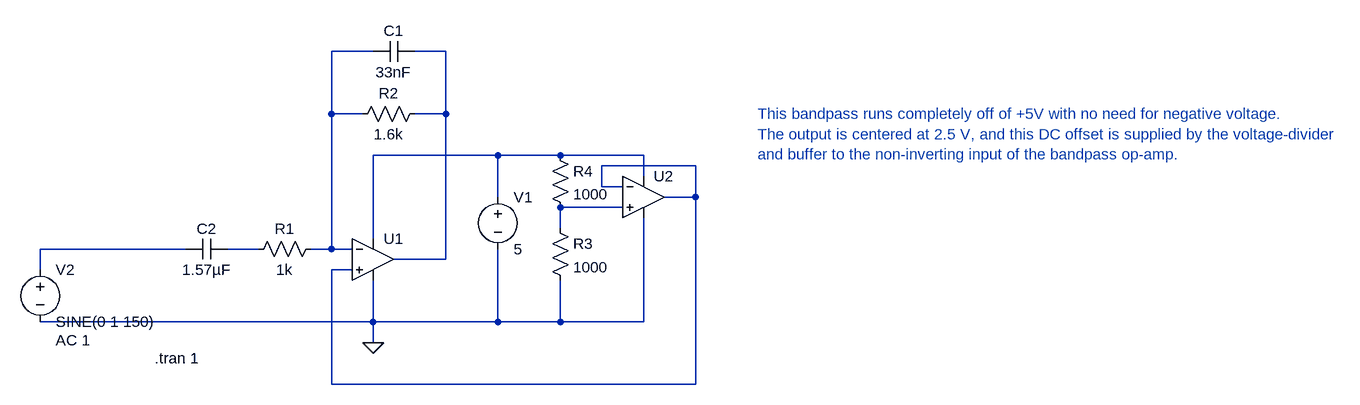
[diagram p0: schematic Bandpass_5Vsupply.asc]
Bandpass_5Vsupply.asc, the LTspice schematic file:
Version 4
SHEET 1 1728 680
WIRE 160 -160 96 -160
WIRE 272 -160 224 -160
WIRE 96 -64 96 -160
WIRE 144 -64 96 -64
WIRE 272 -64 272 -160
WIRE 272 -64 224 -64
WIRE 352 0 160 0
WIRE 448 0 352 0
WIRE 576 0 448 0
WIRE 656 16 512 16
WIRE 576 32 576 0
WIRE 512 48 512 16
WIRE 544 48 512 48
WIRE 352 64 352 0
WIRE 656 64 656 16
WIRE 656 64 608 64
WIRE 544 80 448 80
WIRE 448 112 448 80
WIRE 160 128 160 0
WIRE -128 144 -352 144
WIRE -16 144 -64 144
WIRE 96 144 96 -64
WIRE 96 144 64 144
WIRE 128 144 96 144
WIRE 272 160 272 -64
WIRE 272 160 192 160
WIRE -352 176 -352 144
WIRE 128 176 96 176
WIRE 160 256 160 192
WIRE 160 256 -352 256
WIRE 352 256 352 144
WIRE 352 256 160 256
WIRE 448 256 448 192
WIRE 448 256 352 256
WIRE 576 256 576 96
WIRE 576 256 448 256
WIRE 160 288 160 256
WIRE 96 352 96 176
WIRE 656 352 656 64
WIRE 656 352 96 352
FLAG 160 288 0
SYMBOL res 80 128 R90
WINDOW 0 0 56 VBottom 2
WINDOW 3 32 56 VTop 2
SYMATTR InstName R1
SYMATTR Value 1k
SYMBOL res 240 -80 R90
WINDOW 0 0 56 VBottom 2
WINDOW 3 32 56 VTop 2
SYMATTR InstName R2
SYMATTR Value 1.6k
SYMBOL OpAmps\\UniversalOpamp2 160 160 R0
SYMATTR InstName U1
SYMBOL voltage 352 48 R0
WINDOW 123 0 0 Left 0
WINDOW 39 0 0 Left 0
SYMATTR InstName V1
SYMATTR Value 5
SYMBOL voltage -352 160 R0
WINDOW 123 24 124 Left 2
WINDOW 39 0 0 Left 0
SYMATTR Value2 AC 1
SYMATTR InstName V2
SYMATTR Value SINE(0 1 150)
SYMBOL OpAmps\\UniversalOpamp2 576 64 R0
SYMATTR InstName U2
SYMBOL res 432 96 R0
SYMATTR InstName R3
SYMATTR Value 1000
SYMBOL res 432 -16 R0
SYMATTR InstName R4
SYMATTR Value 1000
SYMBOL cap 224 -176 R90
WINDOW 0 0 32 VBottom 2
WINDOW 3 32 32 VTop 2
SYMATTR InstName C1
SYMATTR Value 33nF
SYMBOL cap -64 128 R90
WINDOW 0 0 32 VBottom 2
WINDOW 3 32 32 VTop 2
SYMATTR InstName C2
SYMATTR Value 1.57µF
TEXT -176 312 Left 2 !.tran 1
TEXT 752 -64 Left 2 ;This bandpass runs completely off of +5V with no need for negative voltage.\nThe output is centered at 2.5 V, and this DC offset is supplied by the voltage-divider\nand buffer to the non-inverting input of the bandpass op-amp.

The netlist it stands for:
* Bandpass_5Vsupply.asc
R1 N001 N007 1k
R2 N002 N001 1.6k
XU1 N004 N001 N003 0 N002 level.2 Avol=1Meg GBW=10Meg Slew=10Meg ilimit=25m rail=0 Vos=0 phimargin=45 en=0 enk=0 in=0 ink=0 Rin=500Meg  ; pins IN+ IN- V+ V- OUT
V1 N003 0 5
V2 N006 0 SINE(0 1 150) AC 1
XU2 N005 N004 N003 0 N004 level.2 Avol=1Meg GBW=10Meg Slew=10Meg ilimit=25m rail=0 Vos=0 phimargin=45 en=0 enk=0 in=0 ink=0 Rin=500Meg  ; pins IN+ IN- V+ V- OUT
R3 N005 0 1000
R4 N003 N005 1000
C1 N002 N001 33nF
C2 N007 N006 1.57µF
.tran 1
* This bandpass runs completely off of +5V with no need for negative voltage.
* The output is centered at 2.5 V, and this DC offset is supplied by the voltage-divider
* and buffer to the non-inverting input of the bandpass op-amp.
.lib UniversalOpamps2.sub
.backanno
.end